# EAGLE schematic OutputIndicator_v1p2 (EAGLE 9.6.1)
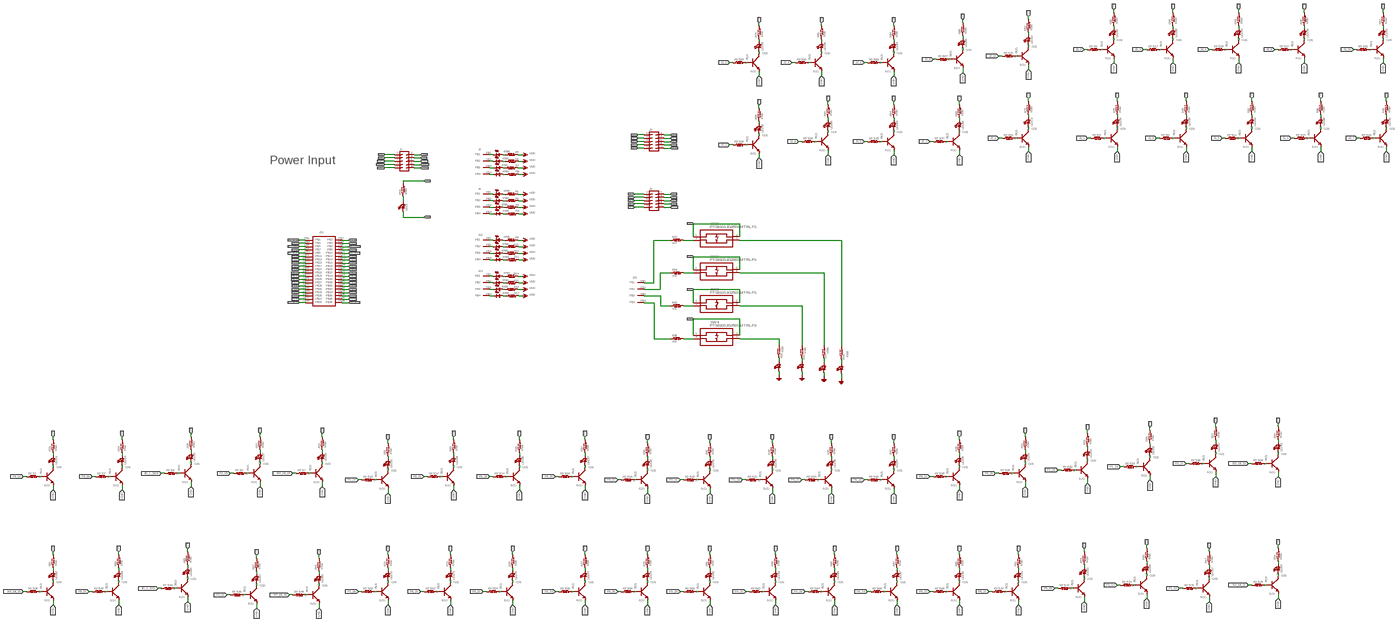
[diagram p0: schematic, sheet 1, overview]
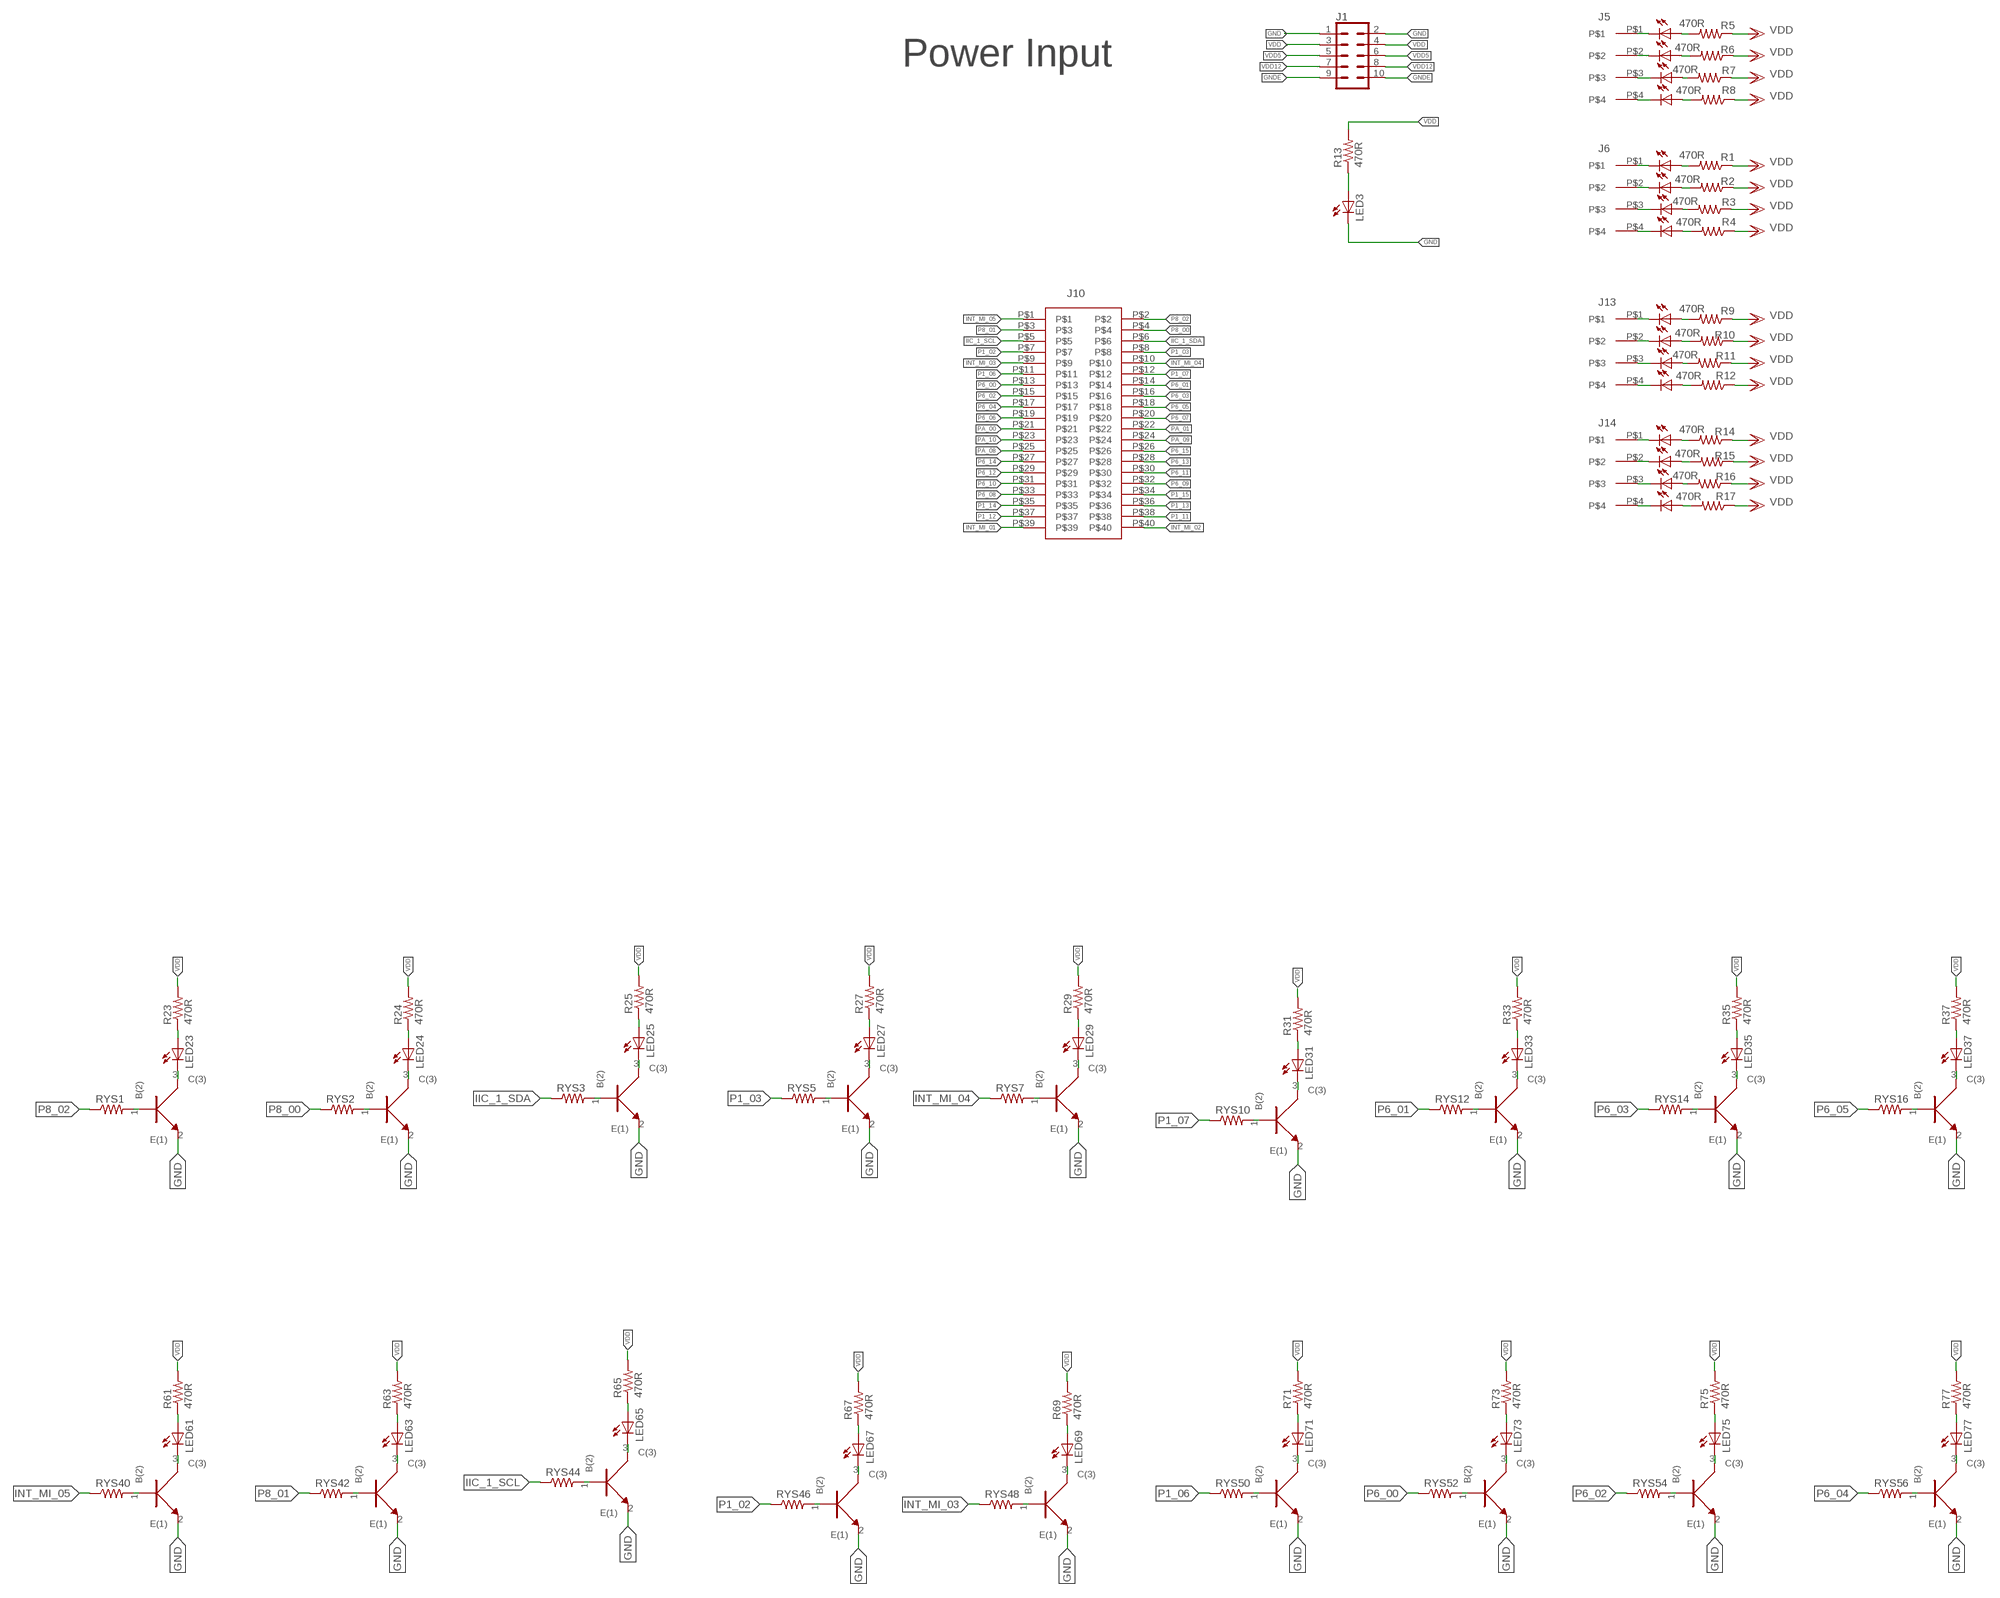
[diagram p1: schematic, sheet 1, part 1 of 5]
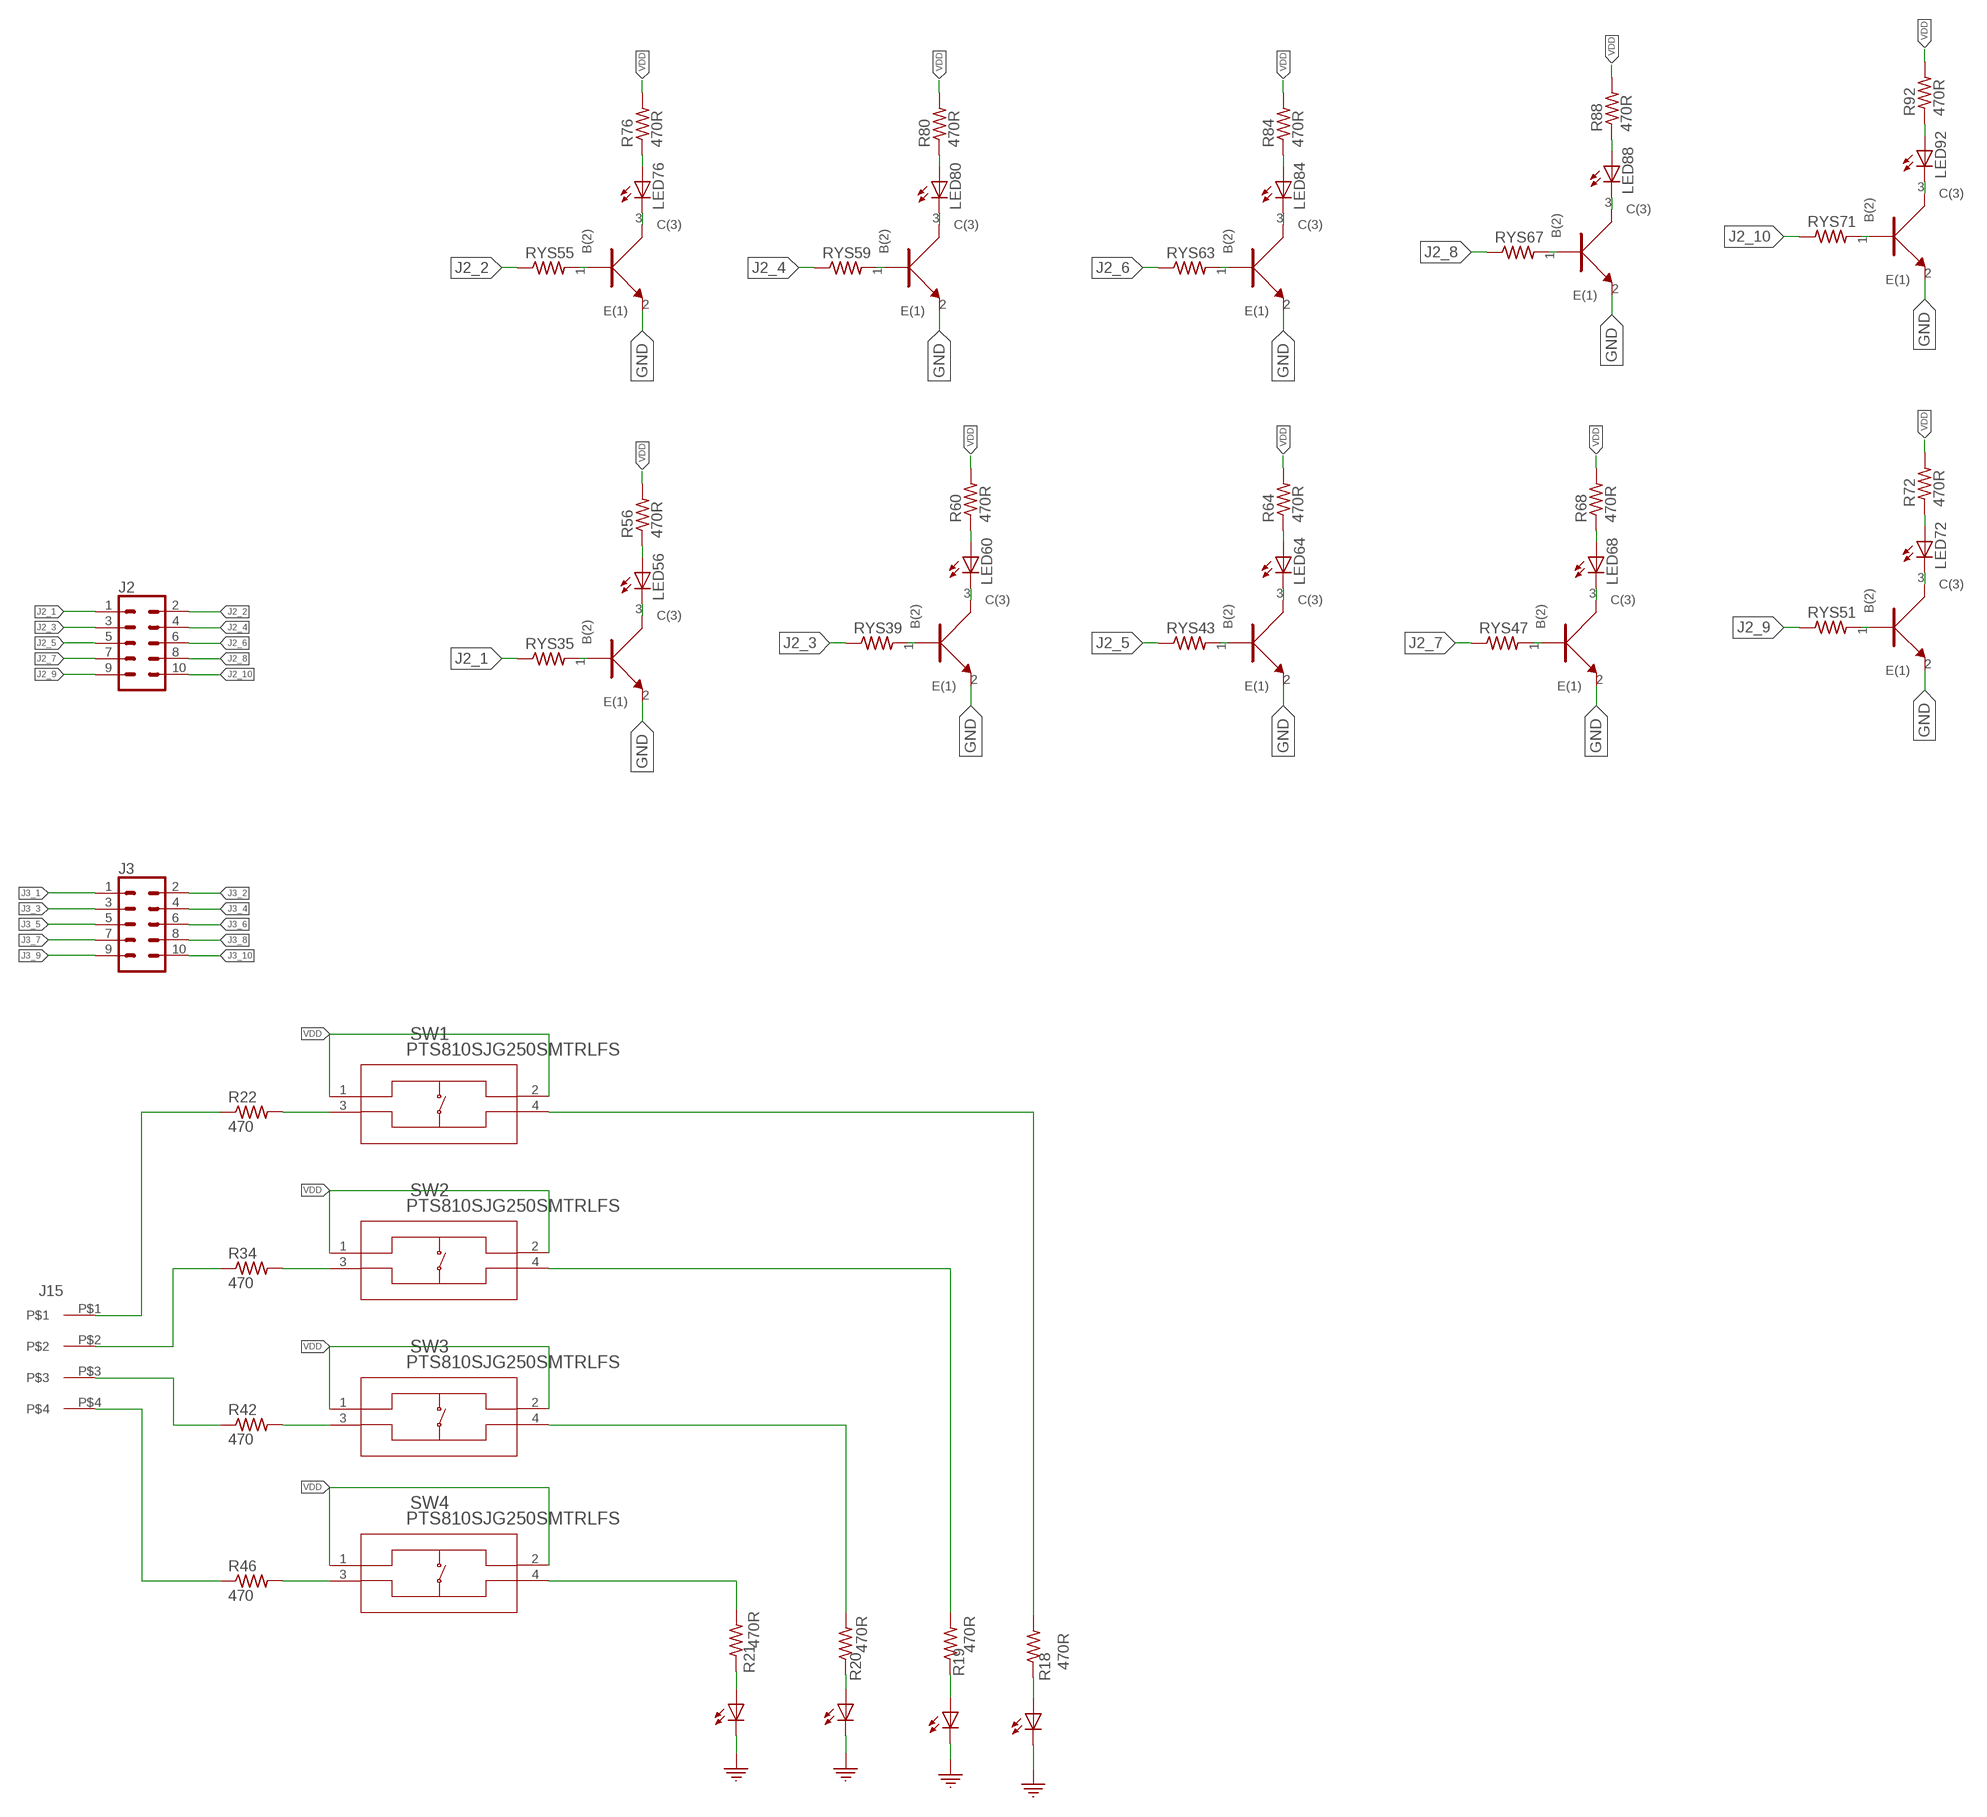
[diagram p2: schematic, sheet 1, part 2 of 5]
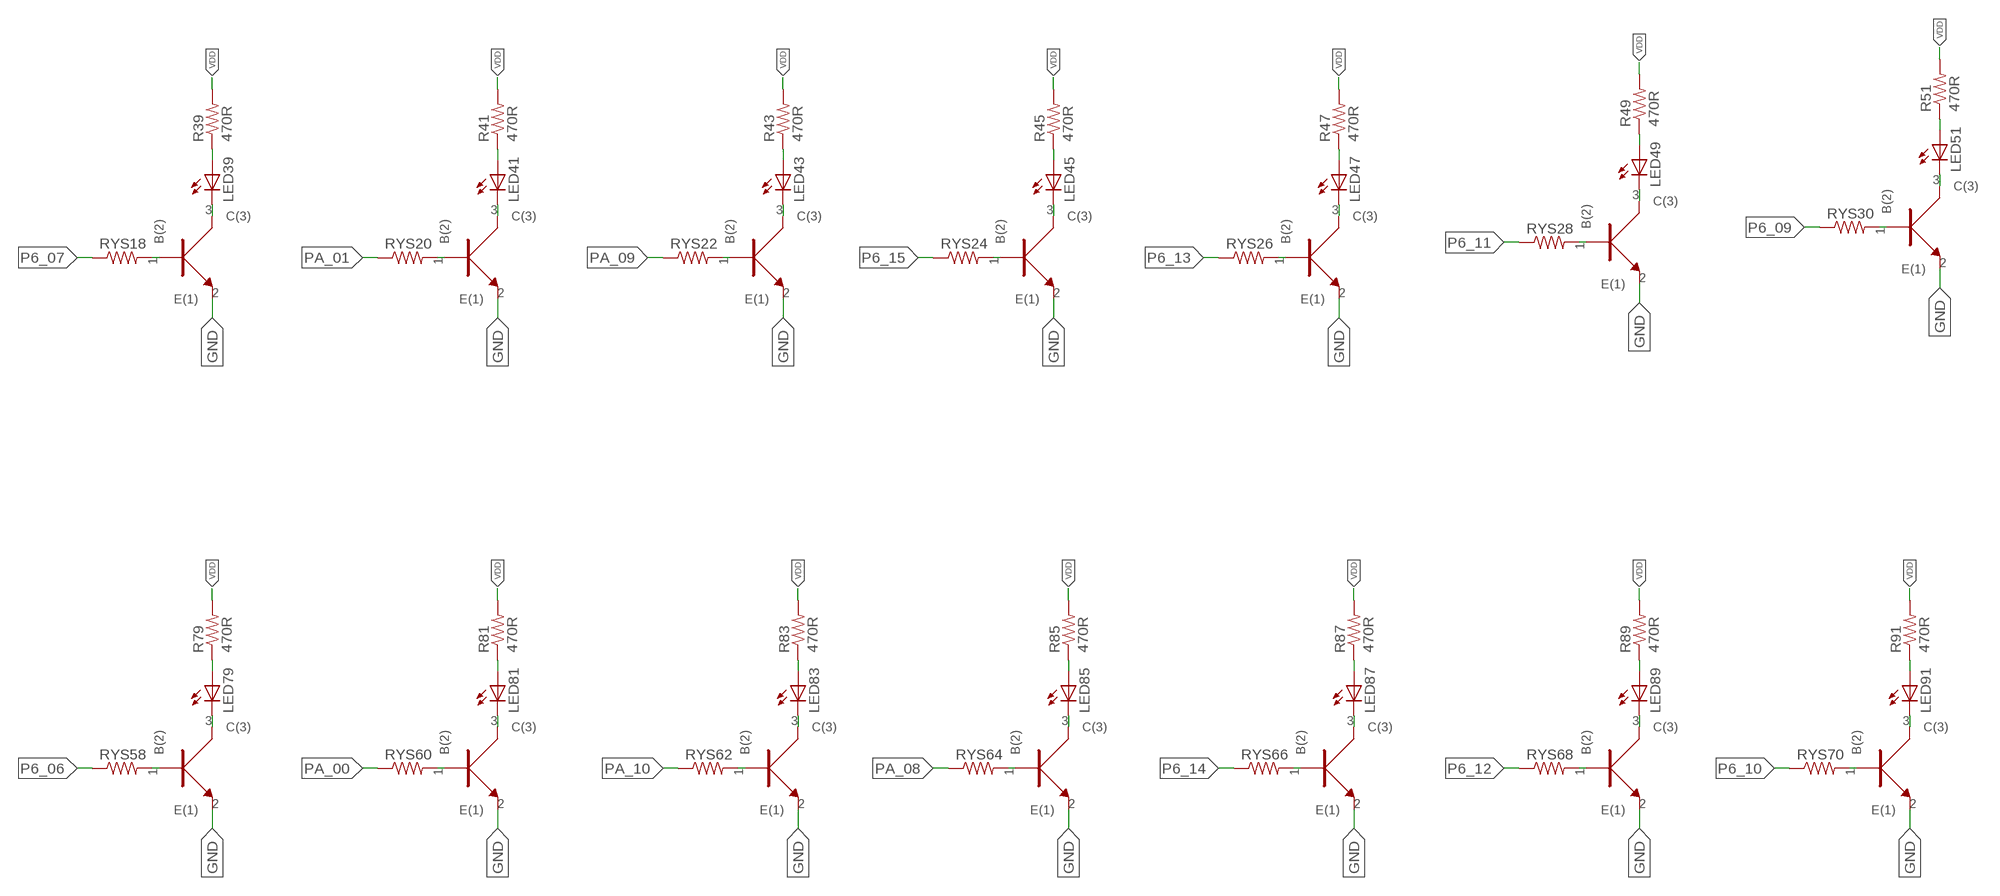
[diagram p3: schematic, sheet 1, part 3 of 5]
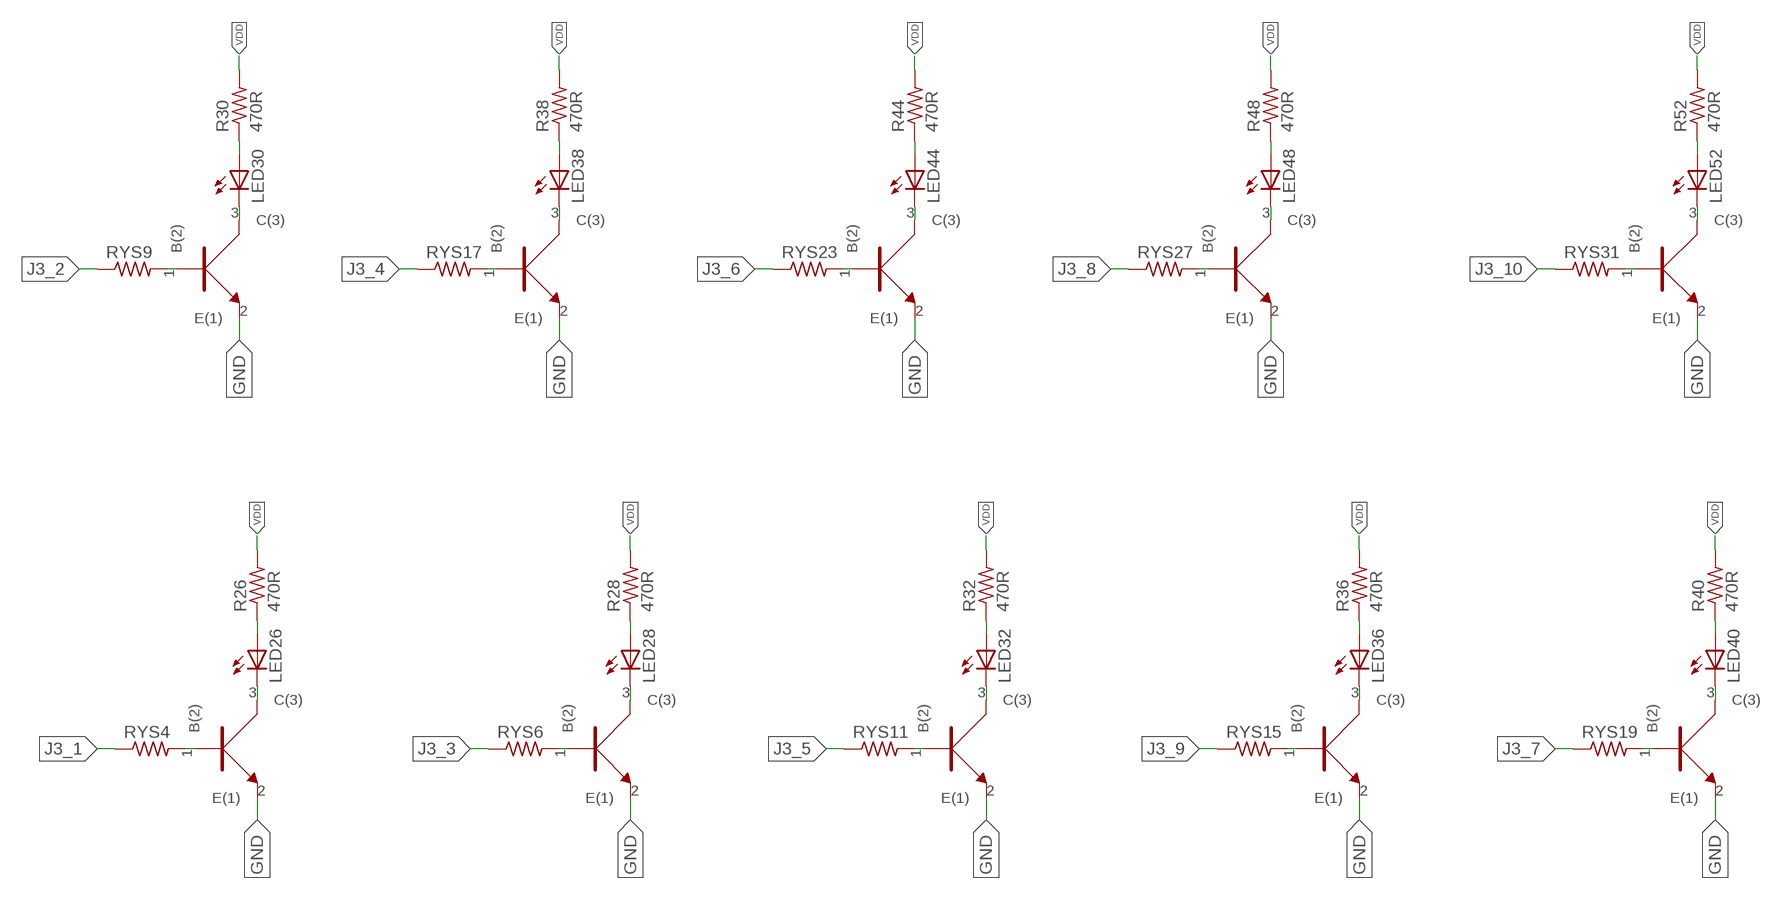
[diagram p4: schematic, sheet 1, part 4 of 5]
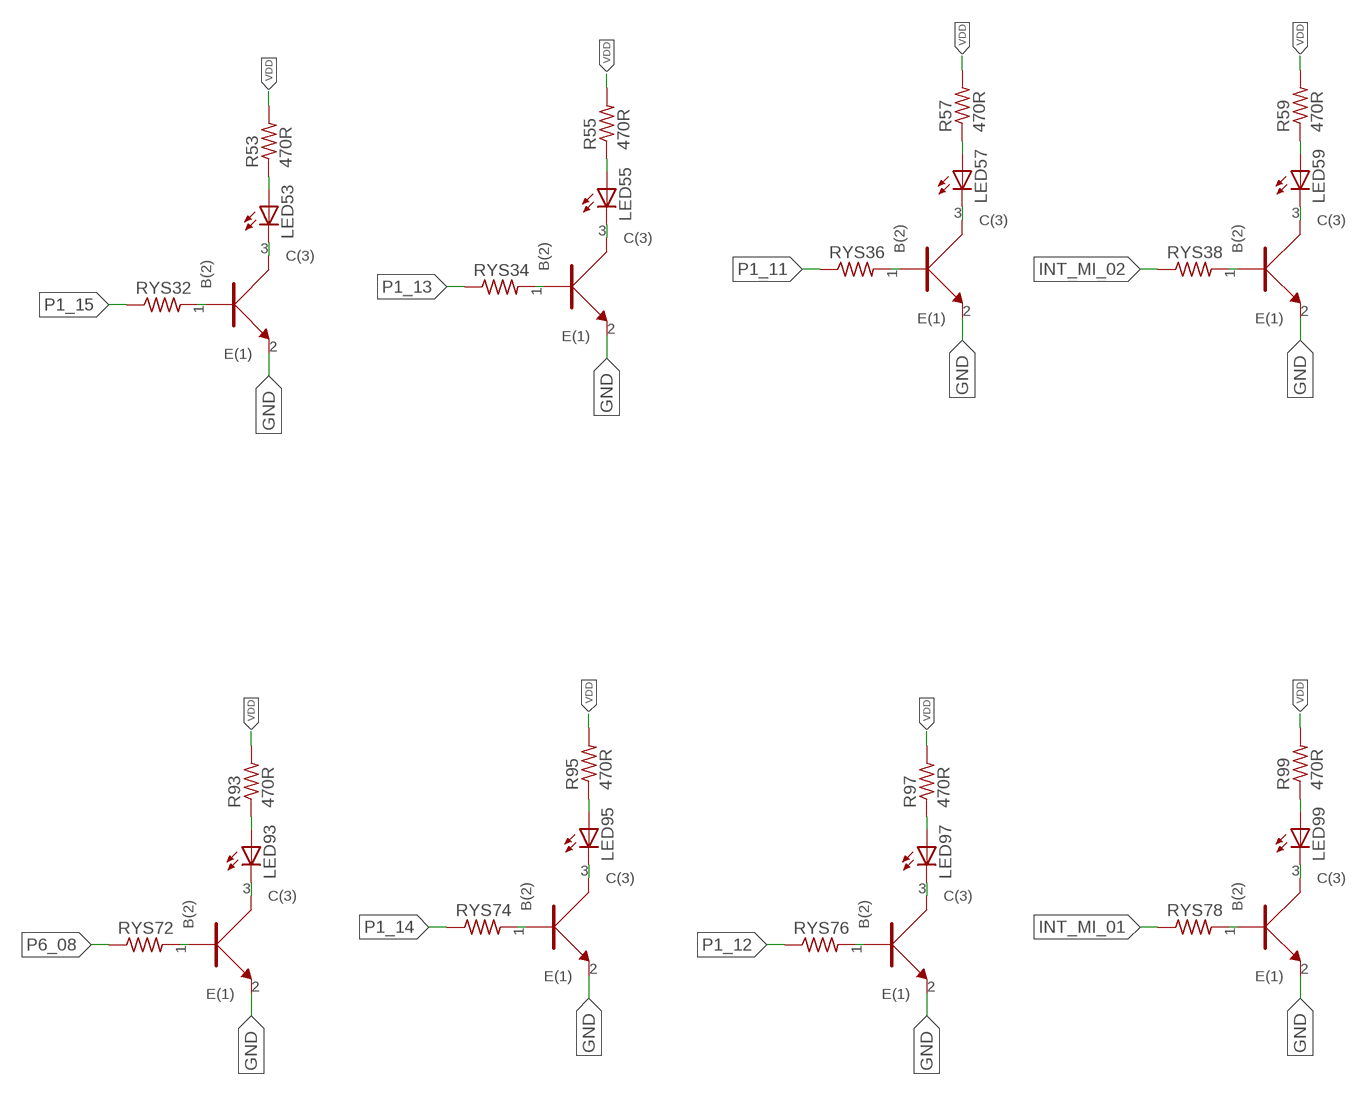
[diagram p5: schematic, sheet 1, part 5 of 5]

## Parts
J1  CONN_05X2PTH  [2X5]
J2  CONN_05X2PTH  [2X5]
J3  CONN_05X2PTH  [2X5]
J5  3.81MM_1_X_4_RT_ANGLE_PLUG_HEADER  [1X4_3.81MM_PITCH]
J6  3.81MM_1_X_4_RT_ANGLE_PLUG_HEADER  [1X4_3.81MM_PITCH]
J10  HEADER_2_X_20_GENERIC  [HEADER_2_X_20_.1_INCH]
J13  3.81MM_1_X_4_RT_ANGLE_PLUG_HEADER  [1X4_3.81MM_PITCH]
J14  3.81MM_1_X_4_RT_ANGLE_PLUG_HEADER  [1X4_3.81MM_PITCH]
J15  3.81MM_1_X_4_RT_ANGLE_PLUG_HEADER  [1X4_3.81MM_PITCH]
LED1  LED_0805_GREEN  [LED_0805_GREEN]
LED2  LED_0805_GREEN  [LED_0805_GREEN]
LED3  LED_0805_GREEN  [LED_0805_GREEN]
LED4  LED_0805_GREEN  [LED_0805_GREEN]
LED5  LED_0805_GREEN  [LED_0805_GREEN]
LED6  LED_0805_GREEN  [LED_0805_GREEN]
LED7  LED_0805_GREEN  [LED_0805_GREEN]
LED8  LED_0805_GREEN  [LED_0805_GREEN]
LED9  LED_0805_GREEN  [LED_0805_GREEN]
LED10  LED_0805_GREEN  [LED_0805_GREEN]
LED11  LED_0805_GREEN  [LED_0805_GREEN]
LED12  LED_0805_GREEN  [LED_0805_GREEN]
LED13  LED_0805_GREEN  [LED_0805_GREEN]
LED14  LED_0805_GREEN  [LED_0805_GREEN]
LED15  LED_0805_GREEN  [LED_0805_GREEN]
LED16  LED_0805_GREEN  [LED_0805_GREEN]
LED17  LED_0805_GREEN  [LED_0805_GREEN]
LED18  LED_0805_GREEN  [LED_0805_GREEN]
LED19  LED_0805_GREEN  [LED_0805_GREEN]
LED20  LED_0805_GREEN  [LED_0805_GREEN]
LED21  LED_0805_GREEN  [LED_0805_GREEN]
LED23  LED_0805_GREEN  [LED_0805_GREEN]
LED24  LED_0805_GREEN  [LED_0805_GREEN]
LED25  LED_0805_GREEN  [LED_0805_GREEN]
LED26  LED_0805_GREEN  [LED_0805_GREEN]
LED27  LED_0805_GREEN  [LED_0805_GREEN]
LED28  LED_0805_GREEN  [LED_0805_GREEN]
LED29  LED_0805_GREEN  [LED_0805_GREEN]
LED30  LED_0805_GREEN  [LED_0805_GREEN]
LED31  LED_0805_GREEN  [LED_0805_GREEN]
LED32  LED_0805_GREEN  [LED_0805_GREEN]
LED33  LED_0805_GREEN  [LED_0805_GREEN]
LED35  LED_0805_GREEN  [LED_0805_GREEN]
LED36  LED_0805_GREEN  [LED_0805_GREEN]
LED37  LED_0805_GREEN  [LED_0805_GREEN]
LED38  LED_0805_GREEN  [LED_0805_GREEN]
LED39  LED_0805_GREEN  [LED_0805_GREEN]
LED40  LED_0805_GREEN  [LED_0805_GREEN]
LED41  LED_0805_GREEN  [LED_0805_GREEN]
LED43  LED_0805_GREEN  [LED_0805_GREEN]
LED44  LED_0805_GREEN  [LED_0805_GREEN]
LED45  LED_0805_GREEN  [LED_0805_GREEN]
LED47  LED_0805_GREEN  [LED_0805_GREEN]
LED48  LED_0805_GREEN  [LED_0805_GREEN]
LED49  LED_0805_GREEN  [LED_0805_GREEN]
LED51  LED_0805_GREEN  [LED_0805_GREEN]
LED52  LED_0805_GREEN  [LED_0805_GREEN]
LED53  LED_0805_GREEN  [LED_0805_GREEN]
LED55  LED_0805_GREEN  [LED_0805_GREEN]
LED56  LED_0805_GREEN  [LED_0805_GREEN]
LED57  LED_0805_GREEN  [LED_0805_GREEN]
LED59  LED_0805_GREEN  [LED_0805_GREEN]
LED60  LED_0805_GREEN  [LED_0805_GREEN]
LED61  LED_0805_GREEN  [LED_0805_GREEN]
LED63  LED_0805_GREEN  [LED_0805_GREEN]
LED64  LED_0805_GREEN  [LED_0805_GREEN]
LED65  LED_0805_GREEN  [LED_0805_GREEN]
LED67  LED_0805_GREEN  [LED_0805_GREEN]
LED68  LED_0805_GREEN  [LED_0805_GREEN]
LED69  LED_0805_GREEN  [LED_0805_GREEN]
LED71  LED_0805_GREEN  [LED_0805_GREEN]
LED72  LED_0805_GREEN  [LED_0805_GREEN]
LED73  LED_0805_GREEN  [LED_0805_GREEN]
LED75  LED_0805_GREEN  [LED_0805_GREEN]
LED76  LED_0805_GREEN  [LED_0805_GREEN]
LED77  LED_0805_GREEN  [LED_0805_GREEN]
LED79  LED_0805_GREEN  [LED_0805_GREEN]
LED80  LED_0805_GREEN  [LED_0805_GREEN]
LED81  LED_0805_GREEN  [LED_0805_GREEN]
LED83  LED_0805_GREEN  [LED_0805_GREEN]
LED84  LED_0805_GREEN  [LED_0805_GREEN]
LED85  LED_0805_GREEN  [LED_0805_GREEN]
LED87  LED_0805_GREEN  [LED_0805_GREEN]
LED88  LED_0805_GREEN  [LED_0805_GREEN]
LED89  LED_0805_GREEN  [LED_0805_GREEN]
LED91  LED_0805_GREEN  [LED_0805_GREEN]
LED92  LED_0805_GREEN  [LED_0805_GREEN]
LED93  LED_0805_GREEN  [LED_0805_GREEN]
LED95  LED_0805_GREEN  [LED_0805_GREEN]
LED97  LED_0805_GREEN  [LED_0805_GREEN]
LED99  LED_0805_GREEN  [LED_0805_GREEN]
R1  470R  R_0402  [0402]
R2  470R  R_0402  [0402]
R3  470R  R_0402  [0402]
R4  470R  R_0402  [0402]
R5  470R  R_0402  [0402]
R6  470R  R_0402  [0402]
R7  470R  R_0402  [0402]
R8  470R  R_0402  [0402]
R9  470R  R_0402  [0402]
R10  470R  R_0402  [0402]
R11  470R  R_0402  [0402]
R12  470R  R_0402  [0402]
R13  470R  R_0402  [0402]
R14  470R  R_0402  [0402]
R15  470R  R_0402  [0402]
R16  470R  R_0402  [0402]
R17  470R  R_0402  [0402]
R18  470R  R_0402  [0402]
R19  470R  R_0402  [0402]
R20  470R  R_0402  [0402]
R21  470R  R_0402  [0402]
R22  470  R_0402  [0402]
R23  470R  R_0402  [0402]
R24  470R  R_0402  [0402]
R25  470R  R_0402  [0402]
R26  470R  R_0402  [0402]
R27  470R  R_0402  [0402]
R28  470R  R_0402  [0402]
R29  470R  R_0402  [0402]
R30  470R  R_0402  [0402]
R31  470R  R_0402  [0402]
R32  470R  R_0402  [0402]
R33  470R  R_0402  [0402]
R34  470  R_0402  [0402]
R35  470R  R_0402  [0402]
R36  470R  R_0402  [0402]
R37  470R  R_0402  [0402]
R38  470R  R_0402  [0402]
R39  470R  R_0402  [0402]
R40  470R  R_0402  [0402]
R41  470R  R_0402  [0402]
R42  470  R_0402  [0402]
R43  470R  R_0402  [0402]
R44  470R  R_0402  [0402]
R45  470R  R_0402  [0402]
R46  470  R_0402  [0402]
R47  470R  R_0402  [0402]
R48  470R  R_0402  [0402]
R49  470R  R_0402  [0402]
R51  470R  R_0402  [0402]
R52  470R  R_0402  [0402]
R53  470R  R_0402  [0402]
R55  470R  R_0402  [0402]
R56  470R  R_0402  [0402]
R57  470R  R_0402  [0402]
R59  470R  R_0402  [0402]
R60  470R  R_0402  [0402]
R61  470R  R_0402  [0402]
R63  470R  R_0402  [0402]
R64  470R  R_0402  [0402]
R65  470R  R_0402  [0402]
R67  470R  R_0402  [0402]
R68  470R  R_0402  [0402]
R69  470R  R_0402  [0402]
R71  470R  R_0402  [0402]
R72  470R  R_0402  [0402]
R73  470R  R_0402  [0402]
R75  470R  R_0402  [0402]
R76  470R  R_0402  [0402]
R77  470R  R_0402  [0402]
R79  470R  R_0402  [0402]
R80  470R  R_0402  [0402]
R81  470R  R_0402  [0402]
R83  470R  R_0402  [0402]
R84  470R  R_0402  [0402]
R85  470R  R_0402  [0402]
R87  470R  R_0402  [0402]
R88  470R  R_0402  [0402]
R89  470R  R_0402  [0402]
R91  470R  R_0402  [0402]
R92  470R  R_0402  [0402]
R93  470R  R_0402  [0402]
R95  470R  R_0402  [0402]
R97  470R  R_0402  [0402]
R99  470R  R_0402  [0402]
RYS1  1K  R_0402  [0402]
RYS2  1K  R_0402  [0402]
RYS3  1K  R_0402  [0402]
RYS4  1K  R_0402  [0402]
RYS5  1K  R_0402  [0402]
RYS6  1K  R_0402  [0402]
RYS7  1K  R_0402  [0402]
RYS9  1K  R_0402  [0402]
RYS10  1K  R_0402  [0402]
RYS11  1K  R_0402  [0402]
RYS12  1K  R_0402  [0402]
RYS14  1K  R_0402  [0402]
RYS15  1K  R_0402  [0402]
RYS16  1K  R_0402  [0402]
RYS17  1K  R_0402  [0402]
RYS18  1K  R_0402  [0402]
RYS19  1K  R_0402  [0402]
RYS20  1K  R_0402  [0402]
RYS22  1K  R_0402  [0402]
RYS23  1K  R_0402  [0402]
RYS24  1K  R_0402  [0402]
RYS26  1K  R_0402  [0402]
RYS27  1K  R_0402  [0402]
RYS28  1K  R_0402  [0402]
RYS30  1K  R_0402  [0402]
RYS31  1K  R_0402  [0402]
RYS32  1K  R_0402  [0402]
RYS34  1K  R_0402  [0402]
RYS35  1K  R_0402  [0402]
RYS36  1K  R_0402  [0402]
RYS38  1K  R_0402  [0402]
RYS39  1K  R_0402  [0402]
RYS40  1K  R_0402  [0402]
RYS42  1K  R_0402  [0402]
RYS43  1K  R_0402  [0402]
RYS44  1K  R_0402  [0402]
RYS46  1K  R_0402  [0402]
RYS47  1K  R_0402  [0402]
RYS48  1K  R_0402  [0402]
RYS50  1K  R_0402  [0402]
RYS51  1K  R_0402  [0402]
RYS52  1K  R_0402  [0402]
RYS54  1K  R_0402  [0402]
RYS55  1K  R_0402  [0402]
RYS56  1K  R_0402  [0402]
RYS58  1K  R_0402  [0402]
RYS59  1K  R_0402  [0402]
RYS60  1K  R_0402  [0402]
RYS62  1K  R_0402  [0402]
RYS63  1K  R_0402  [0402]
RYS64  1K  R_0402  [0402]
RYS66  1K  R_0402  [0402]
RYS67  1K  R_0402  [0402]
RYS68  1K  R_0402  [0402]
RYS70  1K  R_0402  [0402]
RYS71  1K  R_0402  [0402]
RYS72  1K  R_0402  [0402]
RYS74  1K  R_0402  [0402]
RYS76  1K  R_0402  [0402]
RYS78  1K  R_0402  [0402]
SW1  PTS810SJG250SMTRLFS  [PTS810]
SW2  PTS810SJG250SMTRLFS  [PTS810]
SW3  PTS810SJG250SMTRLFS  [PTS810]
SW4  PTS810SJG250SMTRLFS  [PTS810]
U1  BC846BW  [SOT323]
U2  BC846BW  [SOT323]
U3  BC846BW  [SOT323]
U4  BC846BW  [SOT323]
U5  BC846BW  [SOT323]
U6  BC846BW  [SOT323]
U7  BC846BW  [SOT323]
U8  BC846BW  [SOT323]
U9  BC846BW  [SOT323]
U10  BC846BW  [SOT323]
U11  BC846BW  [SOT323]
U13  BC846BW  [SOT323]
U14  BC846BW  [SOT323]
U15  BC846BW  [SOT323]
U16  BC846BW  [SOT323]
U17  BC846BW  [SOT323]
U18  BC846BW  [SOT323]
U20  BC846BW  [SOT323]
U22  BC846BW  [SOT323]
U23  BC846BW  [SOT323]
U24  BC846BW  [SOT323]
U26  BC846BW  [SOT323]
U27  BC846BW  [SOT323]
U28  BC846BW  [SOT323]
U30  BC846BW  [SOT323]
U31  BC846BW  [SOT323]
U32  BC846BW  [SOT323]
U34  BC846BW  [SOT323]
U35  BC846BW  [SOT323]
U36  BC846BW  [SOT323]
U38  BC846BW  [SOT323]
U39  BC846BW  [SOT323]
U40  BC846BW  [SOT323]
U42  BC846BW  [SOT323]
U43  BC846BW  [SOT323]
U44  BC846BW  [SOT323]
U46  BC846BW  [SOT323]
U47  BC846BW  [SOT323]
U48  BC846BW  [SOT323]
U50  BC846BW  [SOT323]
U51  BC846BW  [SOT323]
U52  BC846BW  [SOT323]
U54  BC846BW  [SOT323]
U55  BC846BW  [SOT323]
U56  BC846BW  [SOT323]
U58  BC846BW  [SOT323]
U59  BC846BW  [SOT323]
U60  BC846BW  [SOT323]
U62  BC846BW  [SOT323]
U63  BC846BW  [SOT323]
U64  BC846BW  [SOT323]
U66  BC846BW  [SOT323]
U67  BC846BW  [SOT323]
U68  BC846BW  [SOT323]
U70  BC846BW  [SOT323]
U71  BC846BW  [SOT323]
U72  BC846BW  [SOT323]
U74  BC846BW  [SOT323]
U76  BC846BW  [SOT323]
U78  BC846BW  [SOT323]

## Nets
GND: J1.1 J1.2 LED3.C LED18.C LED19.C LED20.C LED21.C U1.2(E(1)) U2.2(E(1)) U3.2(E(1)) U4.2(E(1)) U5.2(E(1)) U6.2(E(1)) U7.2(E(1)) U8.2(E(1)) U9.2(E(1)) U10.2(E(1)) U11.2(E(1)) U13.2(E(1)) U14.2(E(1)) U15.2(E(1)) U16.2(E(1)) U17.2(E(1)) U18.2(E(1)) U20.2(E(1)) U22.2(E(1)) U23.2(E(1)) U24.2(E(1)) U26.2(E(1)) U27.2(E(1)) U28.2(E(1)) U30.2(E(1)) U31.2(E(1)) U32.2(E(1)) U34.2(E(1)) U35.2(E(1)) U36.2(E(1)) U38.2(E(1)) U39.2(E(1)) U40.2(E(1)) U42.2(E(1)) U43.2(E(1)) U44.2(E(1)) U46.2(E(1)) U47.2(E(1)) U48.2(E(1)) U50.2(E(1)) U51.2(E(1)) U52.2(E(1)) U54.2(E(1)) U55.2(E(1)) U56.2(E(1)) U58.2(E(1)) U59.2(E(1)) U60.2(E(1)) U62.2(E(1)) U63.2(E(1)) U64.2(E(1)) U66.2(E(1)) U67.2(E(1)) U68.2(E(1)) U70.2(E(1)) U71.2(E(1)) U72.2(E(1)) U74.2(E(1)) U76.2(E(1)) U78.2(E(1))
GNDE: J1.9 J1.10
IIC_1_SCL: J10.P$5 RYS44.P$1
IIC_1_SDA: J10.P$6 RYS3.P$1
INT_MI_01: J10.P$39 RYS78.P$1
INT_MI_02: J10.P$40 RYS38.P$1
INT_MI_03: J10.P$9 RYS48.P$1
INT_MI_04: J10.P$10 RYS7.P$1
INT_MI_05: J10.P$1 RYS40.P$1
J2_1: J2.1 RYS35.P$1
J2_2: J2.2 RYS55.P$1
J2_3: J2.3 RYS39.P$1
J2_4: J2.4 RYS59.P$1
J2_5: J2.5 RYS43.P$1
J2_6: J2.6 RYS63.P$1
J2_7: J2.7 RYS47.P$1
J2_8: J2.8 RYS67.P$1
J2_9: J2.9 RYS51.P$1
J2_10: J2.10 RYS71.P$1
J3_1: J3.1 RYS4.P$1
J3_2: J3.2 RYS9.P$1
J3_3: J3.3 RYS6.P$1
J3_4: J3.4 RYS17.P$1
J3_5: J3.5 RYS11.P$1
J3_6: J3.6 RYS23.P$1
J3_7: J3.7 RYS19.P$1
J3_8: J3.8 RYS27.P$1
J3_9: J3.9 RYS15.P$1
J3_10: J3.10 RYS31.P$1
N$1: J5.P$1 LED6.C
N$2: J5.P$2 LED7.C
N$3: LED3.A R13.P$1
N$4: J5.P$3 LED8.C
N$5: J5.P$4 LED9.C
N$6: LED9.A R8.P$2
N$7: LED8.A R7.P$2
N$8: LED7.A R6.P$2
N$9: LED6.A R5.P$2
N$10: J6.P$1 LED1.C
N$11: J6.P$2 LED2.C
N$12: J6.P$3 LED4.C
N$13: J6.P$4 LED5.C
N$14: LED5.A R4.P$2
N$15: LED2.A R2.P$2
N$16: LED1.A R1.P$2
N$17: LED4.A R3.P$2
N$18: J13.P$1 LED10.C
N$19: J13.P$2 LED11.C
N$20: J13.P$3 LED12.C
N$21: J13.P$4 LED13.C
N$22: LED13.A R12.P$2
N$23: LED11.A R10.P$2
N$24: LED10.A R9.P$2
N$25: LED12.A R11.P$2
N$26: J14.P$1 LED14.C
N$27: J14.P$2 LED15.C
N$28: J14.P$3 LED16.C
N$29: J14.P$4 LED17.C
N$30: LED17.A R17.P$2
N$31: LED15.A R15.P$2
N$32: LED14.A R14.P$2
N$33: LED16.A R16.P$2
N$34: J15.P$1 R22.P$1
N$35: J15.P$2 R34.P$1
N$36: J15.P$3 R42.P$1
N$37: J15.P$4 R46.P$1
N$38: LED18.A R18.P$1
N$39: LED19.A R19.P$1
N$40: LED20.A R20.P$1
N$41: LED21.A R21.P$1
N$42: R21.P$2 SW4.4
N$43: R20.P$2 SW3.4
N$44: R19.P$2 SW2.4
N$45: RYS1.P$2 U1.1(B(2))
N$46: LED23.A R23.P$1
N$47: LED23.C U1.3(C(3))
N$48: RYS2.P$2 U2.1(B(2))
N$49: LED24.A R24.P$1
N$50: LED24.C U2.3(C(3))
N$51: RYS3.P$2 U3.1(B(2))
N$52: LED25.A R25.P$1
N$53: LED25.C U3.3(C(3))
N$54: RYS4.P$2 U4.1(B(2))
N$55: LED26.A R26.P$1
N$56: LED26.C U4.3(C(3))
N$57: RYS5.P$2 U5.1(B(2))
N$58: LED27.A R27.P$1
N$59: LED27.C U5.3(C(3))
N$60: RYS6.P$2 U6.1(B(2))
N$61: LED28.A R28.P$1
N$62: LED28.C U6.3(C(3))
N$63: RYS7.P$2 U7.1(B(2))
N$64: LED29.A R29.P$1
N$65: LED29.C U7.3(C(3))
N$66: RYS9.P$2 U8.1(B(2))
N$67: LED30.A R30.P$1
N$68: LED30.C U8.3(C(3))
N$69: RYS10.P$2 U9.1(B(2))
N$70: LED31.A R31.P$1
N$71: LED31.C U9.3(C(3))
N$72: RYS11.P$2 U10.1(B(2))
N$73: LED32.A R32.P$1
N$74: LED32.C U10.3(C(3))
N$75: RYS12.P$2 U11.1(B(2))
N$76: LED33.A R33.P$1
N$77: LED33.C U11.3(C(3))
N$78: R18.P$2 SW1.4
N$79: R22.P$2 SW1.3
N$80: R34.P$2 SW2.3
N$81: RYS14.P$2 U13.1(B(2))
N$82: LED35.A R35.P$1
N$83: LED35.C U13.3(C(3))
N$84: RYS15.P$2 U14.1(B(2))
N$85: LED36.A R36.P$1
N$86: LED36.C U14.3(C(3))
N$87: RYS16.P$2 U15.1(B(2))
N$88: LED37.A R37.P$1
N$89: LED37.C U15.3(C(3))
N$90: RYS17.P$2 U16.1(B(2))
N$91: LED38.A R38.P$1
N$92: LED38.C U16.3(C(3))
N$93: RYS18.P$2 U17.1(B(2))
N$94: LED39.A R39.P$1
N$95: LED39.C U17.3(C(3))
N$96: RYS19.P$2 U18.1(B(2))
N$97: LED40.A R40.P$1
N$98: LED40.C U18.3(C(3))
N$99: RYS20.P$2 U20.1(B(2))
N$100: LED41.A R41.P$1
N$101: LED41.C U20.3(C(3))
N$102: R42.P$2 SW3.3
N$103: R46.P$2 SW4.3
N$105: RYS22.P$2 U22.1(B(2))
N$106: LED43.A R43.P$1
N$107: LED43.C U22.3(C(3))
N$108: RYS23.P$2 U23.1(B(2))
N$109: LED44.A R44.P$1
N$110: LED44.C U23.3(C(3))
N$111: RYS24.P$2 U24.1(B(2))
N$112: LED45.A R45.P$1
N$113: LED45.C U24.3(C(3))
N$117: RYS26.P$2 U26.1(B(2))
N$118: LED47.A R47.P$1
N$119: LED47.C U26.3(C(3))
N$120: RYS27.P$2 U27.1(B(2))
N$121: LED48.A R48.P$1
N$122: LED48.C U27.3(C(3))
N$123: RYS28.P$2 U28.1(B(2))
N$124: LED49.A R49.P$1
N$125: LED49.C U28.3(C(3))
N$129: RYS30.P$2 U30.1(B(2))
N$130: LED51.A R51.P$1
N$131: LED51.C U30.3(C(3))
N$132: RYS31.P$2 U31.1(B(2))
N$133: LED52.A R52.P$1
N$134: LED52.C U31.3(C(3))
N$135: RYS32.P$2 U32.1(B(2))
N$136: LED53.A R53.P$1
N$137: LED53.C U32.3(C(3))
N$141: RYS34.P$2 U34.1(B(2))
N$142: LED55.A R55.P$1
N$143: LED55.C U34.3(C(3))
N$144: RYS35.P$2 U35.1(B(2))
N$145: LED56.A R56.P$1
N$146: LED56.C U35.3(C(3))
N$147: RYS36.P$2 U36.1(B(2))
N$148: LED57.A R57.P$1
N$149: LED57.C U36.3(C(3))
N$153: RYS38.P$2 U38.1(B(2))
N$154: LED59.A R59.P$1
N$155: LED59.C U38.3(C(3))
N$156: RYS39.P$2 U39.1(B(2))
N$157: LED60.A R60.P$1
N$158: LED60.C U39.3(C(3))
N$159: RYS40.P$2 U40.1(B(2))
N$160: LED61.A R61.P$1
N$161: LED61.C U40.3(C(3))
N$165: RYS42.P$2 U42.1(B(2))
N$166: LED63.A R63.P$1
N$167: LED63.C U42.3(C(3))
N$168: RYS43.P$2 U43.1(B(2))
N$169: LED64.A R64.P$1
N$170: LED64.C U43.3(C(3))
N$171: RYS44.P$2 U44.1(B(2))
N$172: LED65.A R65.P$1
N$173: LED65.C U44.3(C(3))
N$177: RYS46.P$2 U46.1(B(2))
N$178: LED67.A R67.P$1
N$179: LED67.C U46.3(C(3))
N$180: RYS47.P$2 U47.1(B(2))
N$181: LED68.A R68.P$1
N$182: LED68.C U47.3(C(3))
N$183: RYS48.P$2 U48.1(B(2))
N$184: LED69.A R69.P$1
N$185: LED69.C U48.3(C(3))
N$189: RYS50.P$2 U50.1(B(2))
N$190: LED71.A R71.P$1
N$191: LED71.C U50.3(C(3))
N$192: RYS51.P$2 U51.1(B(2))
N$193: LED72.A R72.P$1
N$194: LED72.C U51.3(C(3))
N$195: RYS52.P$2 U52.1(B(2))
N$196: LED73.A R73.P$1
N$197: LED73.C U52.3(C(3))
N$201: RYS54.P$2 U54.1(B(2))
N$202: LED75.A R75.P$1
N$203: LED75.C U54.3(C(3))
N$204: RYS55.P$2 U55.1(B(2))
N$205: LED76.A R76.P$1
N$206: LED76.C U55.3(C(3))
N$207: RYS56.P$2 U56.1(B(2))
N$208: LED77.A R77.P$1
N$209: LED77.C U56.3(C(3))
N$213: RYS58.P$2 U58.1(B(2))
N$214: LED79.A R79.P$1
N$215: LED79.C U58.3(C(3))
N$216: RYS59.P$2 U59.1(B(2))
N$217: LED80.A R80.P$1
N$218: LED80.C U59.3(C(3))
N$219: RYS60.P$2 U60.1(B(2))
N$220: LED81.A R81.P$1
N$221: LED81.C U60.3(C(3))
N$225: RYS62.P$2 U62.1(B(2))
N$226: LED83.A R83.P$1
N$227: LED83.C U62.3(C(3))
N$228: RYS63.P$2 U63.1(B(2))
N$229: LED84.A R84.P$1
N$230: LED84.C U63.3(C(3))
N$231: RYS64.P$2 U64.1(B(2))
N$232: LED85.A R85.P$1
N$233: LED85.C U64.3(C(3))
N$237: RYS66.P$2 U66.1(B(2))
N$238: LED87.A R87.P$1
N$239: LED87.C U66.3(C(3))
N$240: RYS67.P$2 U67.1(B(2))
N$241: LED88.A R88.P$1
N$242: LED88.C U67.3(C(3))
N$243: RYS68.P$2 U68.1(B(2))
N$244: LED89.A R89.P$1
N$245: LED89.C U68.3(C(3))
N$249: RYS70.P$2 U70.1(B(2))
N$250: LED91.A R91.P$1
N$251: LED91.C U70.3(C(3))
N$252: RYS71.P$2 U71.1(B(2))
N$253: LED92.A R92.P$1
N$254: LED92.C U71.3(C(3))
N$255: RYS72.P$2 U72.1(B(2))
N$256: LED93.A R93.P$1
N$257: LED93.C U72.3(C(3))
N$261: RYS74.P$2 U74.1(B(2))
N$262: LED95.A R95.P$1
N$263: LED95.C U74.3(C(3))
N$267: RYS76.P$2 U76.1(B(2))
N$268: LED97.A R97.P$1
N$269: LED97.C U76.3(C(3))
N$273: RYS78.P$2 U78.1(B(2))
N$274: LED99.A R99.P$1
N$275: LED99.C U78.3(C(3))
P1_02: J10.P$7 RYS46.P$1
P1_03: J10.P$8 RYS5.P$1
P1_06: J10.P$11 RYS50.P$1
P1_07: J10.P$12 RYS10.P$1
P1_11: J10.P$38 RYS36.P$1
P1_12: J10.P$37 RYS76.P$1
P1_13: J10.P$36 RYS34.P$1
P1_14: J10.P$35 RYS74.P$1
P1_15: J10.P$34 RYS32.P$1
P6_00: J10.P$13 RYS52.P$1
P6_01: J10.P$14 RYS12.P$1
P6_02: J10.P$15 RYS54.P$1
P6_03: J10.P$16 RYS14.P$1
P6_04: J10.P$17 RYS56.P$1
P6_05: J10.P$18 RYS16.P$1
P6_06: J10.P$19 RYS58.P$1
P6_07: J10.P$20 RYS18.P$1
P6_08: J10.P$33 RYS72.P$1
P6_09: J10.P$32 RYS30.P$1
P6_10: J10.P$31 RYS70.P$1
P6_11: J10.P$30 RYS28.P$1
P6_12: J10.P$29 RYS68.P$1
P6_13: J10.P$28 RYS26.P$1
P6_14: J10.P$27 RYS66.P$1
P6_15: J10.P$26 RYS24.P$1
P8_00: J10.P$4 RYS2.P$1
P8_01: J10.P$3 RYS42.P$1
P8_02: J10.P$2 RYS1.P$1
PA_00: J10.P$21 RYS60.P$1
PA_01: J10.P$22 RYS20.P$1
PA_08: J10.P$25 RYS64.P$1
PA_09: J10.P$24 RYS22.P$1
PA_10: J10.P$23 RYS62.P$1
VDD: J1.3 J1.4 R1.P$1 R2.P$1 R3.P$1 R4.P$1 R5.P$1 R6.P$1 R7.P$1 R8.P$1 R9.P$1 R10.P$1 R11.P$1 R12.P$1 R13.P$2 R14.P$1 R15.P$1 R16.P$1 R17.P$1 R23.P$2 R24.P$2 R25.P$2 R26.P$2 R27.P$2 R28.P$2 R29.P$2 R30.P$2 R31.P$2 R32.P$2 R33.P$2 R35.P$2 R36.P$2 R37.P$2 R38.P$2 R39.P$2 R40.P$2 R41.P$2 R43.P$2 R44.P$2 R45.P$2 R47.P$2 R48.P$2 R49.P$2 R51.P$2 R52.P$2 R53.P$2 R55.P$2 R56.P$2 R57.P$2 R59.P$2 R60.P$2 R61.P$2 R63.P$2 R64.P$2 R65.P$2 R67.P$2 R68.P$2 R69.P$2 R71.P$2 R72.P$2 R73.P$2 R75.P$2 R76.P$2 R77.P$2 R79.P$2 R80.P$2 R81.P$2 R83.P$2 R84.P$2 R85.P$2 R87.P$2 R88.P$2 R89.P$2 R91.P$2 R92.P$2 R93.P$2 R95.P$2 R97.P$2 R99.P$2 SW1.1 SW1.2 SW2.1 SW2.2 SW3.1 SW3.2 SW4.1 SW4.2
VDD5: J1.5 J1.6
VDD12: J1.7 J1.8

## Notes on the sheet
- Power Input

## Library data of the parts
J1-J3 = 3D_MIG_Controller:CONN_05X2: Multi connection point. Often used as Generic Header-pin footprint for 0.1 inch spaced/style header connections For AVR SPI programming port, see special device with nice symbol: "AVR_SPI_PROG_5x2.dev" You can populate with any combo of single row headers, but if you'd like an exact match, check these: 2x5 AVR ICSP Male Header <https://www.sparkfun.com/products/778> (PRT-00778) 2x5 Pin Shrouded Header <https://www.sparkfun.com/products/8506> (PRT-08506) On any of the 0.1 inch spaced packages, you can populate with these: Break Away Headers - Straight <https://www.sparkfun.com/products/116> (PRT-00116) Break Away Male Headers - Right Angle <https://www.sparkfun.com/products/553> (PRT-00553) Female Headers <https://www.sparkfun.com/products/115> (PRT-00115) Break Away Headers - Machine Pin <https://www.sparkfun.com/products/117> (PRT-00117) Break Away Female Headers - Swiss Machine Pin <https://www.sparkfun.com/products/743> (PRT-00743) Special note: the shrouded connector mates well with our 5x2 ribbon cables: 2x5 Pin IDC Ribbon Cable <https://www.sparkfun.com/products/8535> (PRT-08535); PROD_ID: CONN-08499; SF_ID: PRT-0778
J5 J6 J13-J15 = 3D_MIG_Controller:3.81MM_1_X_4_RT_ANGLE_PLUG_HEADER
J10 = 3D_MIG_Controller:HEADER_2_X_20_GENERIC
LED1-LED21 LED23-LED33 LED35-LED41 LED43-LED45 LED47-LED49 LED51-LED53 LED55-LED57 LED59-LED61 LED63-LED65 LED67-LED69 LED71-LED73 LED75-LED77 LED79-LED81 LED83-LED85 LED87-LED89 LED91-LED93 LED95 LED97 LED99 = 3D_MIG_Controller:LED_0805_GREEN
R1-R49 R51-R53 R55-R57 R59-R61 R63-R65 R67-R69 R71-R73 R75-R77 R79-R81 R83-R85 R87-R89 R91-R93 R95 R97 R99 RYS1-RYS7 RYS9-RYS12 RYS14-RYS20 RYS22-RYS24 RYS26-RYS28 RYS30-RYS32 RYS34-RYS36 RYS38-RYS40 RYS42-RYS44 RYS46-RYS48 RYS50-RYS52 RYS54-RYS56 RYS58-RYS60 RYS62-RYS64 RYS66-RYS68 RYS70-RYS72 RYS74 RYS76 RYS78 = 3D_MIG_Controller:R_0402
SW1-SW4 = 3D_MIG_Controller:PTS810SJG250SMTRLFS; BUILT_BY: EMA_Cory; COPYRIGHT: Copyright (C) 2018 Accelerated Designs. All rights reserved; DATASHEET: https://www.ckswitches.com/products/tactile/PTS810/#PTS810SJG250SMTRLFS; MANUFACTURER_PART_NUMBER: PTS810SJG250SMTRLFS; VENDOR: C&K
U1-U11 U13-U18 U20 U22-U24 U26-U28 U30-U32 U34-U36 U38-U40 U42-U44 U46-U48 U50-U52 U54-U56 U58-U60 U62-U64 U66-U68 U70-U72 U74 U76 U78 = 3D_MIG_Controller:BC846BW; MANUFACTURER_PART_NUMBER: BC846BW; VENDOR: Nexperia